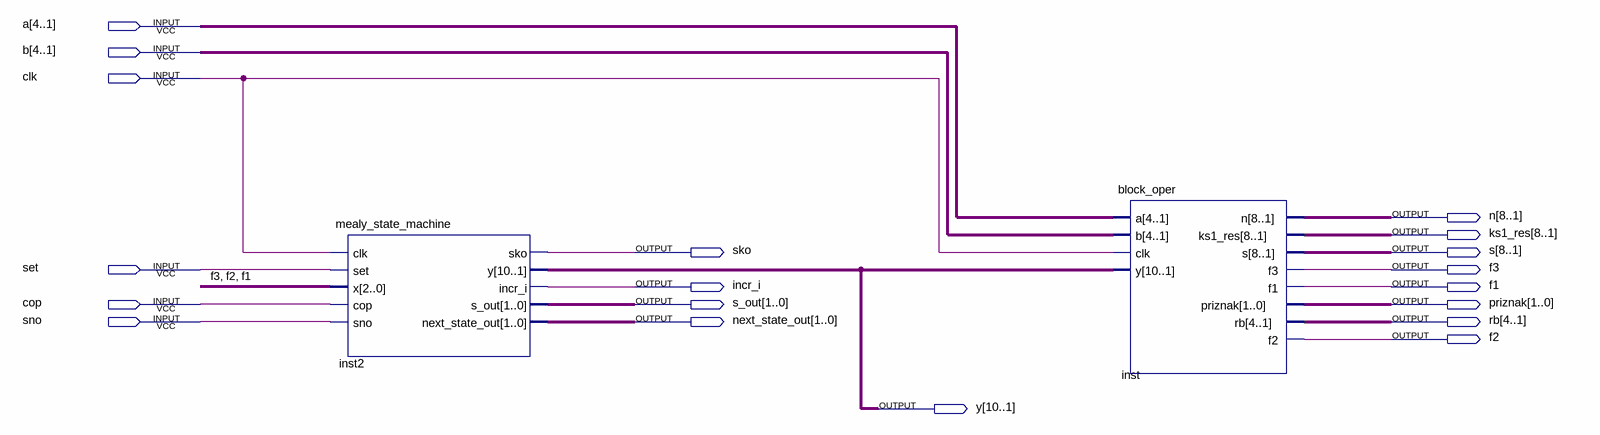
[diagram p0: schematic sheet]
// Quartus schematic alu.bdf as structural Verilog: 2 symbols, 19 pins
module alu (
  input  [4:1] a,
  input  [4:1] b,
  input  clk,
  input  set,
  input  cop,
  input  sno,
  output [8:1] n,
  output [8:1] ks1_res,
  output sko,
  output [8:1] s,
  output f3,
  output incr_i,
  output f1,
  output [1:0] s_out,
  output [1:0] priznak,
  output [1:0] next_state_out,
  output [4:1] rb,
  output f2,
  output [10:1] y
);

  mealy_state_machine inst2 (
    .clk(clk), .set(set), .x({f3, f2, f1}), .cop(cop), .sno(sno), .sko(sko), .y(y), .incr_i(incr_i),
    .s_out(s_out), .next_state_out(next_state_out));
  block_oper inst (
    .a(a), .b(b), .clk(clk), .y(y), .n(n), .ks1_res(ks1_res), .s(s), .f3(f3), .f1(f1), .priznak(priznak),
    .rb(rb), .f2(f2));
endmodule
